# Altium schematic sheet [7]-H3_POWER.SchDoc
size A4
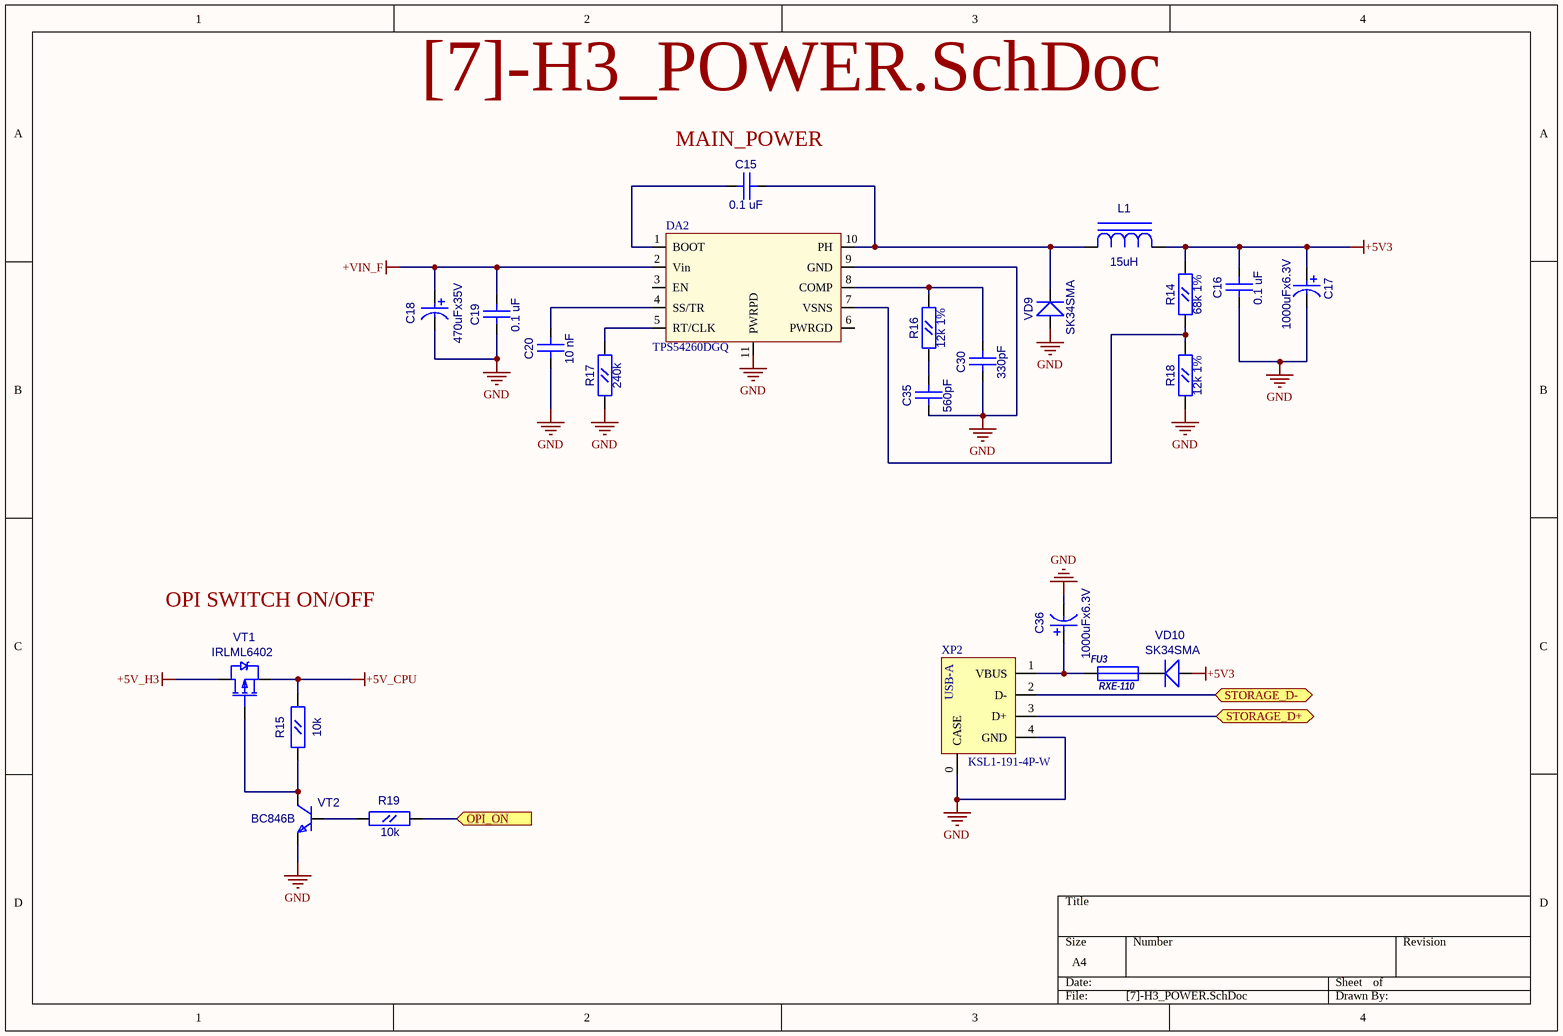
[diagram p0: [7]-H3_POWER.SchDoc]

## Parts
C15  0.1 uF  [CC0603]
C16  0.1 uF  [CC0603]
C17  1000uFx6.3V  [CC8X3.5]
C18  470uFx35V  [CC16X10_CAP0.5(1)(Primary)]
C19  0.1 uF  [CC0603]
C20  10 nF  [CC0603]
C30  330pF  [CC0603]
C35  560pF  [CC0603]
C36  value 1000uFx6.3V  [CC8X3.5]  (hidden comment: CAP0.35)
DA2  TPS54260DGQ  [S-PDSO-G10]
FU3  RXE-110  [RXE-110]
L1  15uH  [SDR0805]
R14  68k 1%  [RC0603]
R15  10k  [RC0603]
R16  12k 1%  [RC0603]
R17  240k  [RC0603]
R18  12k 1%  [RC0603]
R19  10k  [RC0603]
VD9  SK34SMA  [SMA]
VD10  SK34SMA  [SMA]
VT1  IRLML6402  [SOT-23(123)]
VT2  BC846B  [SOT-23(123)]
XP2  KSL1-191-4P-W  [USB_A_REAR]

## Ports
OPI_ON (in), STORAGE_D+ (bidir), STORAGE_D- (bidir)

## Nets
+5V3: C16.1(A) C17.1 L1.2(A) R14.2(B) VD10.1(A)
+5V_CPU: R15.2(B) VT1.2(S)
+5V_H3: VT1.3(D)
+VIN_F: C18.2 C19.1(A) DA2.2(Vin)
GND: C16.2(B) C17.2 C18.1 C19.2(B) C20.2(B) C30.2(B) C35.2(B) C36.2 DA2.9(GND) DA2.11(PWRPD) R17.1(A) R18.1(A) VD9.1(A) VT2.2(E) XP2.0(CASE) XP2.4(GND)
OPI_ON: R19.2(B) ; port OPI_ON
STORAGE_D+: XP2.3(D+) ; port STORAGE_D+
STORAGE_D-: XP2.2(D-) ; port STORAGE_D-
NetC15_1: C15.1(A) DA2.10(PH) L1.1(C) VD9.2(K)
NetC15_2: C15.2(B) DA2.1(BOOT)
NetC20_1: C20.1(A) DA2.4(SS/TR)
NetC30_1: C30.1(A) DA2.8(COMP) R16.2(B)
NetC35_1: C35.1(A) R16.1(A)
NetC36_1: C36.1 FU3.1 XP2.1(VBUS)
NetDA2_5: DA2.5(RT/CLK) R17.2(B)
NetDA2_7: DA2.7(VSNS) R14.1(A) R18.2(B)
NetFU3_2: FU3.2 VD10.2(K)
NetR15_1: R15.1(A) VT1.1(G) VT2.3(C)
NetR19_1: R19.1(A) VT2.1(B)

Not connected (* = marked no-connect by the designer): DA2 3(EN) 6(PWRGD)

## Notes on the sheet
- (near C15) MAIN_POWER
- OPI SWITCH ON/OFF
- (in symbol USB_A_REAR) USB-A

## Library data of the parts
C15 C16 C19 C20 C30 C35 = CC0603
  C15 C16 C19: Value: 0.1 uF
  C20: Value: 10 nF
  C30: Value: 330pF
  C35: Value: 560pF
C17 = CAP0.35: Value: 1000uFx6.3V
C18 = CAP0.5(1): Value: 470uFx35V
L1 = SDR0805: Value: 15uH
R14-R19 = RC0603
  R14: Value: 68k 1%
  R15 R19: Value: 10k
  R16 R18: Value: 12k 1%
  R17: Value: 240k
VD9 VD10 = SK34SMA: Schottky Rectifier; Value: {Value}
VT1 = IRLML6402: HEXFET Power MOSFET; OriginalName: IRLML5103; ComponentField7: Published 8-Jun-2000; Value: IRLML6402
VT2 = BC846BLT1: ComponentField7: Published 29-Sep-2000; OriginalName: BC846BLT1; Value: BC846B
XP2 = USB_A_REAR: USB A rear side connector; Value: KSL1-191-4P-W
FU3 = RXE-110: Value: *